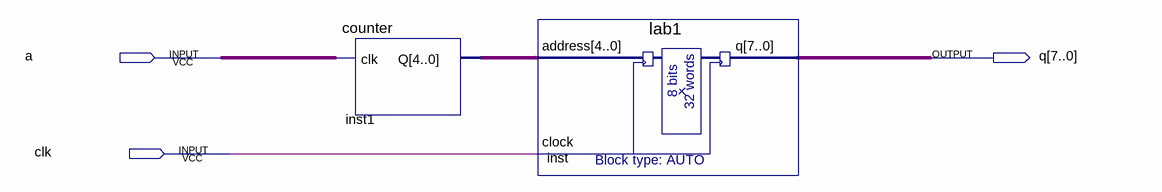
[diagram p0: schematic sheet]
// Quartus schematic block1.bdf as structural Verilog: 2 symbols, 3 pins
module block1 (
  input  a,
  input  clk,
  output [7:0] q
);

  wire [4:0] inst1_q;

  counter inst1 (.clk(a), .Q(inst1_q));
  lab1 inst (.address(inst1_q), .clock(clk), .q(q));
endmodule
